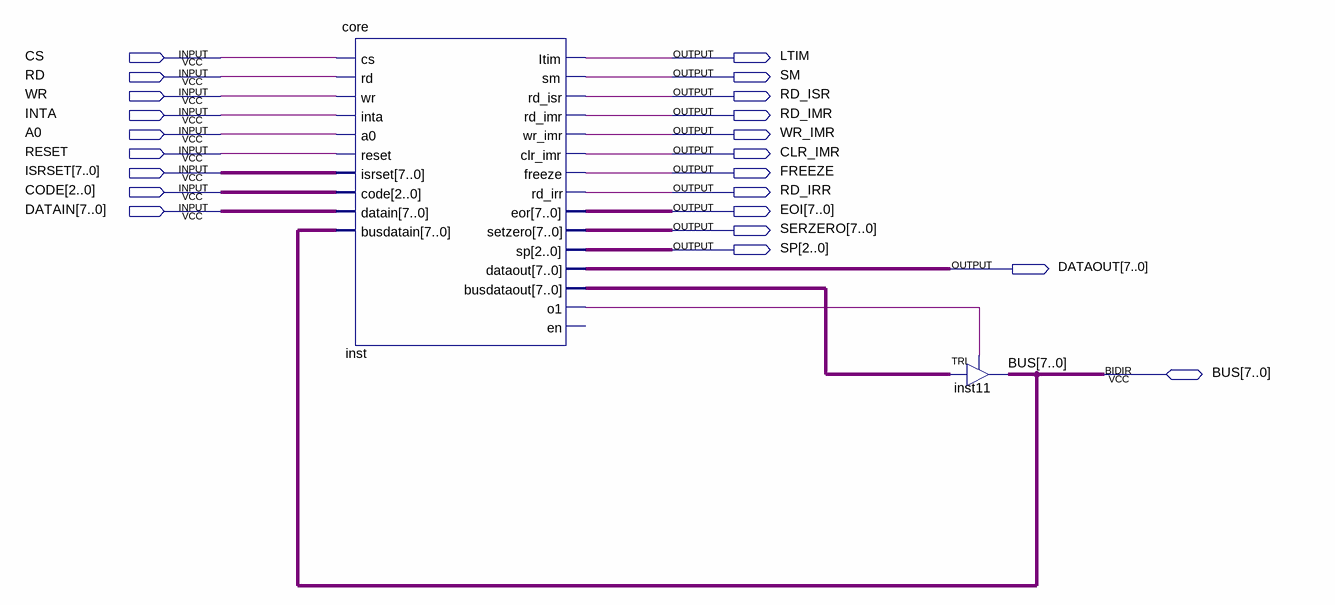
[diagram p0: schematic sheet]
// Quartus schematic CORE_DOWN.bdf as structural Verilog: 2 symbols, 22 pins
module CORE_DOWN (
  input  CS,
  input  RD,
  input  WR,
  input  INTA,
  input  A0,
  input  RESET,
  input  [7:0] ISRSET,
  input  [2:0] CODE,
  input  [7:0] DATAIN,
  inout  [7:0] BUS,
  output LTIM,
  output SM,
  output RD_ISR,
  output RD_IMR,
  output WR_IMR,
  output CLR_IMR,
  output FREEZE,
  output RD_IRR,
  output [7:0] EOI,
  output [7:0] SERZERO,
  output [2:0] SP,
  output [7:0] DATAOUT
);

  wire inst_o1;
  wire [7:0] inst_busdataout;

  core inst (
    .cs(CS), .rd(RD), .wr(WR), .inta(INTA), .a0(A0), .reset(RESET), .isrset(ISRSET), .code(CODE),
    .datain(DATAIN), .busdatain(BUS), .Itim(LTIM), .sm(SM), .rd_isr(RD_ISR), .rd_imr(RD_IMR),
    .wr_imr(WR_IMR), .clr_imr(CLR_IMR), .freeze(FREEZE), .rd_irr(RD_IRR), .eor(EOI), .setzero(SERZERO),
    .sp(SP), .dataout(DATAOUT), .busdataout(inst_busdataout), .o1(inst_o1));  // open: en
  TRI inst11[7:0] (.IN(inst_busdataout), .OE(inst_o1), .OUT(BUS));
endmodule
